# Altium schematic sheet switches.SchDoc
size 594 x 419 mm
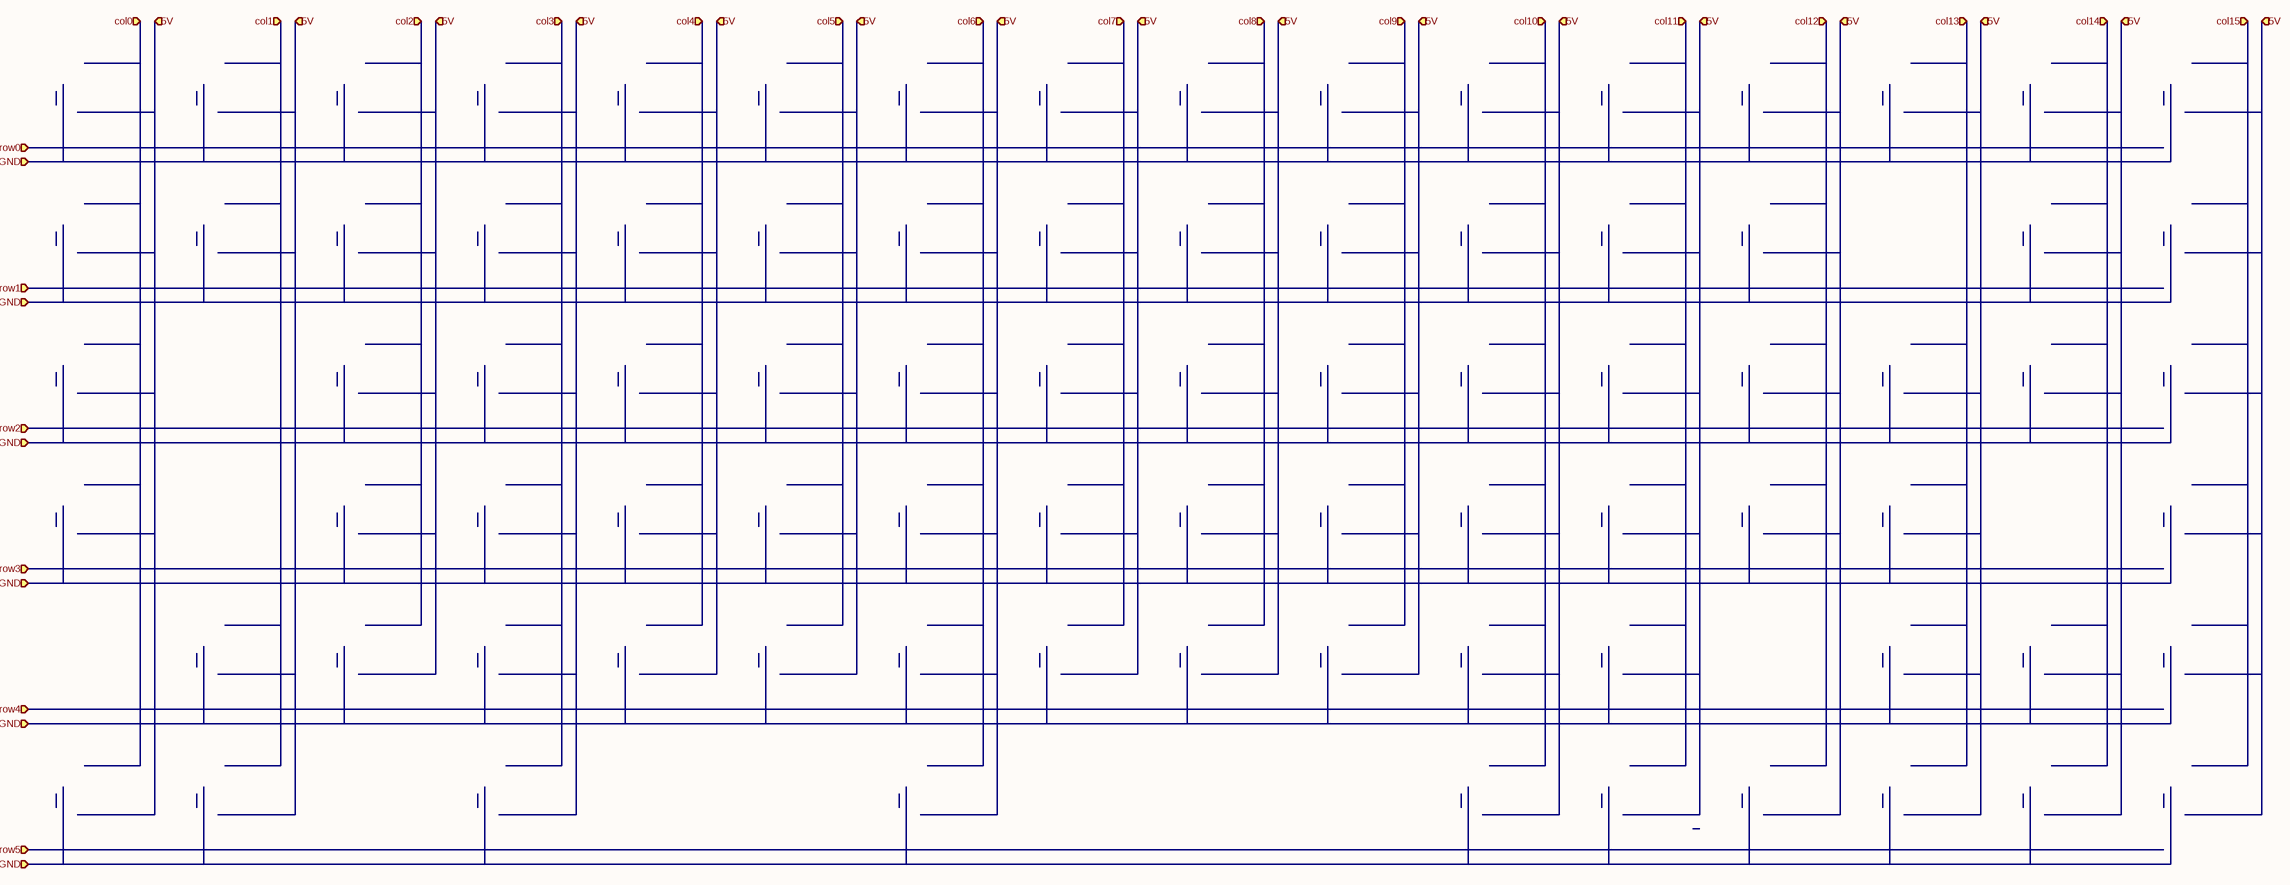
[diagram p0: switches.SchDoc]

## Ports
5V (in), col0 (in), col1 (in), col2 (in), col3 (in), col4 (in), col5 (in), col6 (in), col7 (in), col8 (in), col9 (in), col10 (in), col11 (in), col12 (in), col13 (in), col14 (in), col15 (in), LEDGND (in), row0 (in), row1 (in), row2 (in), row3 (in), row4 (in), row5 (in)

## Notes on the sheet
- 1
- 2
- 3
- 4
- 5
- 6
- 7
- 8
- 9
- 10
- 11
- A
- B
- C
- D
- E
- F
- G
- H
- Title:
- File: switches.sch
- Sheet: /
- KiCad E.D.A.  kicad (5.1.4)-1
- Size: A4
- Date:
- Rev:
- Id: 2/2